# Altium schematic sheet Sensor_AirPressure_1Wire.SchDoc
size A4; Organization: Q-Tech Design; Address1: Da Nang City; Address2: Viet Nam; DocumentNumber: 4; SheetNumber: 4; SheetTotal: 7
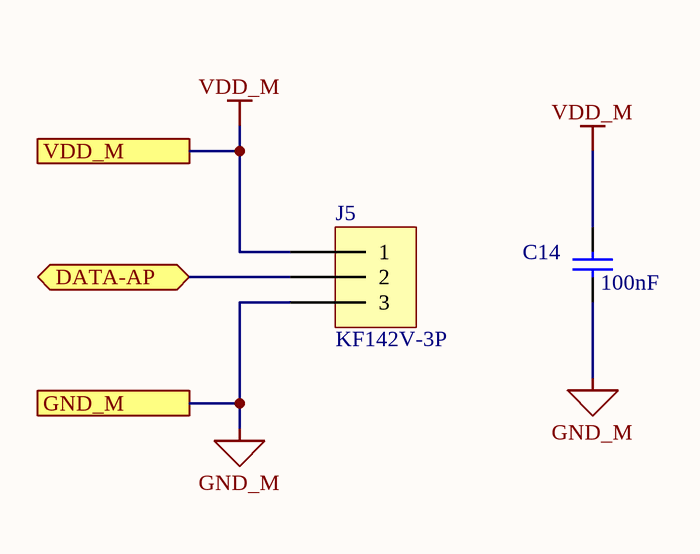
[diagram p0: Sensor_AirPressure_1Wire.SchDoc]

## Parts
C14  100nF  [CAPC1608X87N]
J5  KF142V-3P  [CON KF142V-3P-5.08]

## Ports
DATA-AP (bidir), GND_M, VDD_M

## Nets
GND_M: C14.1 J5.3 ; port GND_M
VDD_M: C14.2 J5.1 ; port VDD_M
DATA-AP: J5.2 ; port DATA-AP

## Notes on the sheet
- Page Title:
- Date:
- Title:
- DRE:
- Time:
- Number:
- Sheet
- Rev:
- of
- Q-Tech confidential and proprietary. Restricted access under NDA. Do not reproduce. Store and dispose securely.

## Library data of the parts
C14 = CC0603_100NF_50V_10%_X7R: Non-polarised capacitor; Part Description: SMD Multilayer Chip Ceramic Capacitor; Manufacturer: GENERIC; Manufacturer1 Part Number: 223858615649; Voltage: 50V; TC: X7R; Tolerance: ±10%; Table: Capacitors SMD; Part Number: CC0603_100NF_50V_10%_X7R; Component Kind: Standard; Component Type: Standard; Pin Count: 2; Value: 100nF; Status: Preferred; Manufacturer Part Number: CC0603_100NF_50V_10%_X7R; Case: 0603; Mounted: Yes; Socket: No; SMD: Yes; Manufacturer1 Example: PHYCOMP; Manufacturer1 ComponentHeight: 0.87mm; HelpURL: \\cern.ch\dfs\Applications\Altium\Datasheets\CC0603_X7R_PHYCOMP.pdf; Author: CERN DEM JLC; CreateDate: 03-Dec-07; LatestRevisionDate: 03-Dec-07
J5 = CON KF142V-3P-5.08